# EAGLE schematic pcb_v2.0 (EAGLE 9.1.1)
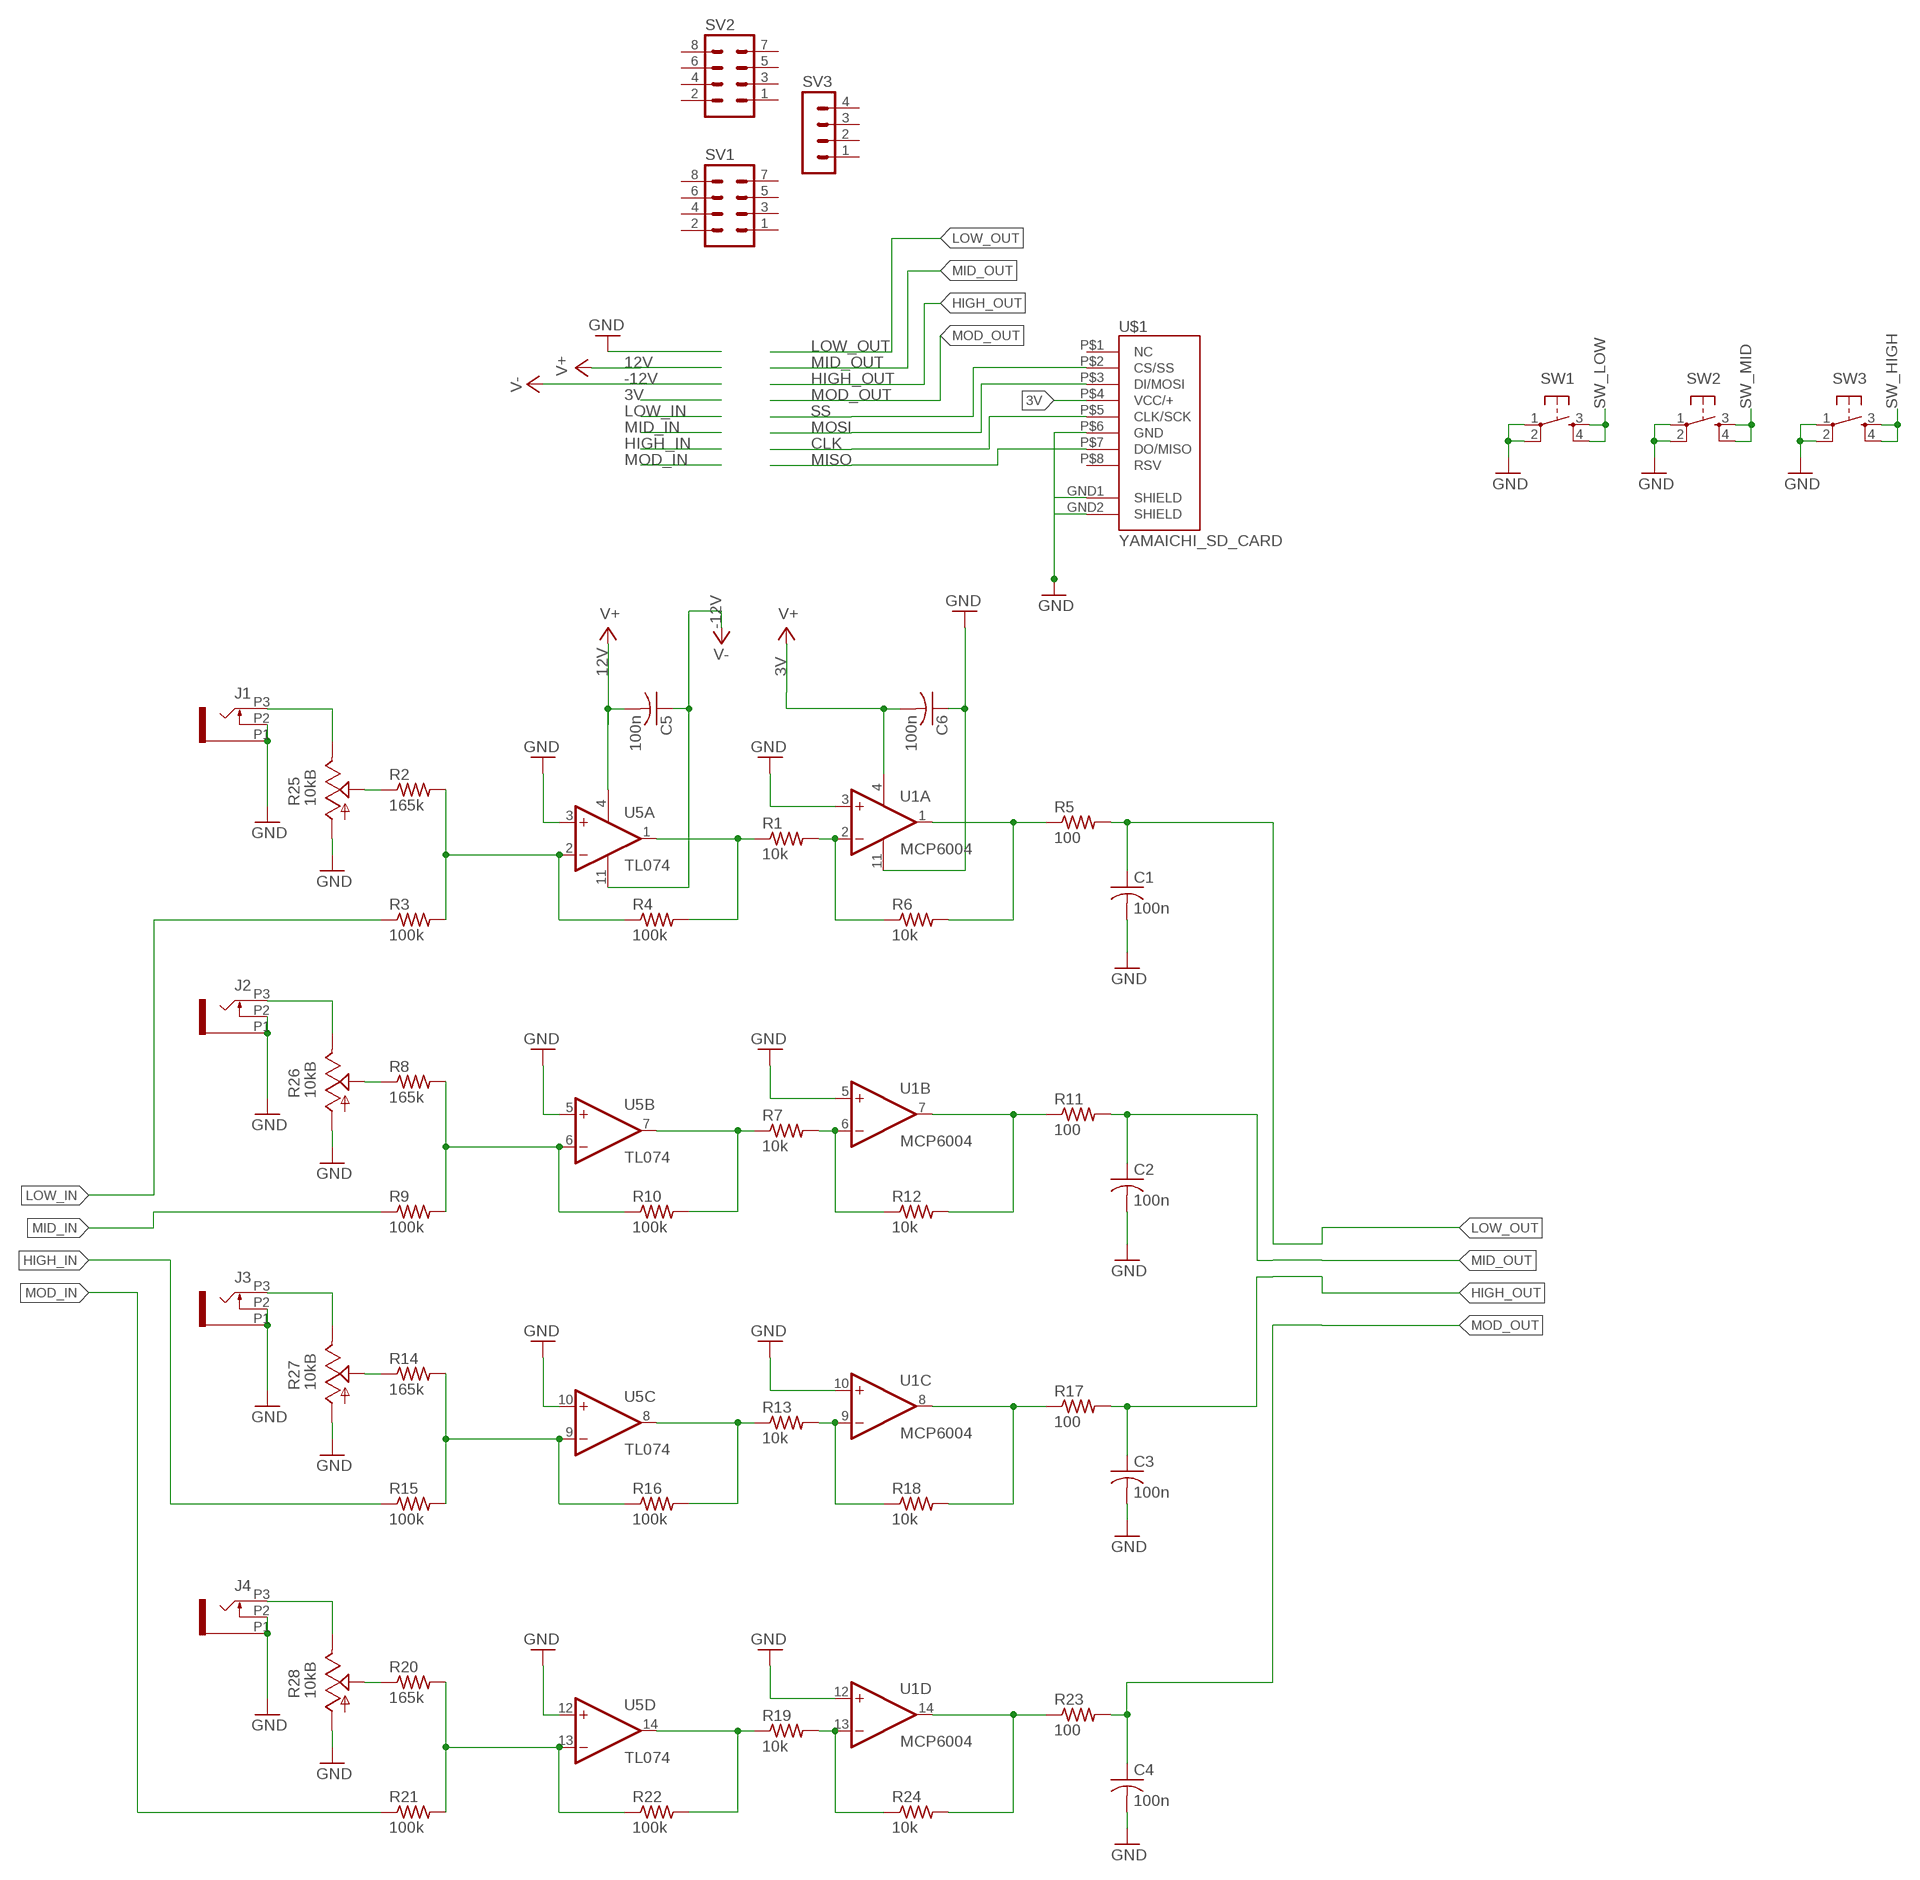
[diagram p0: schematic, sheet 1]

## Parts
C1  100n  C-USC0603  [C0603]
C2  100n  C-USC0603  [C0603]
C3  100n  C-USC0603  [C0603]
C4  100n  C-USC0603  [C0603]
C5  100n  C-USC0603  [C0603]
C6  100n  C-USC0603  [C0603]
J1  PJ301_THONKICONN6  [WQP_PJ_301M6]
J2  PJ301_THONKICONN6  [WQP_PJ_301M6]
J3  PJ301_THONKICONN6  [WQP_PJ_301M6]
J4  PJ301_THONKICONN6  [WQP_PJ_301M6]
R1  10k  R-US_R0603  [R0603]
R2  165k  R-US_R0603  [R0603]
R3  100k  R-US_R0603  [R0603]
R4  100k  R-US_R0603  [R0603]
R5  100  R-US_R0603  [R0603]
R6  10k  R-US_R0603  [R0603]
R7  10k  R-US_R0603  [R0603]
R8  165k  R-US_R0603  [R0603]
R9  100k  R-US_R0603  [R0603]
R10  100k  R-US_R0603  [R0603]
R11  100  R-US_R0603  [R0603]
R12  10k  R-US_R0603  [R0603]
R13  10k  R-US_R0603  [R0603]
R14  165k  R-US_R0603  [R0603]
R15  100k  R-US_R0603  [R0603]
R16  100k  R-US_R0603  [R0603]
R17  100  R-US_R0603  [R0603]
R18  10k  R-US_R0603  [R0603]
R19  10k  R-US_R0603  [R0603]
R20  165k  R-US_R0603  [R0603]
R21  100k  R-US_R0603  [R0603]
R22  100k  R-US_R0603  [R0603]
R23  100  R-US_R0603  [R0603]
R24  10k  R-US_R0603  [R0603]
R25  10kB  POT_USVERTICAL  [ALPS_POT_VERTICAL]
R26  10kB  POT_USVERTICAL  [ALPS_POT_VERTICAL]
R27  10kB  POT_USVERTICAL  [ALPS_POT_VERTICAL]
R28  10kB  POT_USVERTICAL  [ALPS_POT_VERTICAL]
SV1  MA04-2  [MA04-2]
SV2  MA04-2  [MA04-2]
SV3  MA04-1  [MA04-1]
SW1  TAC_SWITCHPTH  [TACTILE-PTH]
SW2  TAC_SWITCHPTH  [TACTILE-PTH]
SW3  TAC_SWITCHPTH  [TACTILE-PTH]
U1  MCP6004  MCP6004_SMD  [SO14]
U5  TL074  TL074_SMD  [SO14]
U$1  YAMAICHI_SD_CARD  [YAMAICHI_MICROSD_VERTICAL]

## Nets
3V: C6.2 U1.4(P:V+) ; supply symbol labelled V+
12V: C5.2 U5.4(P:V+) ; supply symbol labelled V+
-12V: C5.1 U5.11(P:V-) ; supply symbol labelled V-
CLK: U$1.P$5(CLK/SCK)
GND: C1.2 C2.2 C3.2 C4.2 C6.1 J1.P1 J1.P2 J2.P1 J2.P2 J3.P1 J3.P2 J4.P1 J4.P2 R25.P$3(A) R26.P$3(A) R27.P$3(A) R28.P$3(A) SW1.1 SW1.2 SW2.1 SW2.2 SW3.1 SW3.2 U1.3(A:+IN) U1.5(B:+IN) U1.10(C:+IN) U1.11(P:V-) U1.12(D:+IN) U5.3(A:+IN) U5.5(B:+IN) U5.10(C:+IN) U5.12(D:+IN) U$1.GND1(SHIELD) U$1.GND2(SHIELD) U$1.P$6(GND)
HIGH_IN: R15.1
HIGH_OUT: C3.1 R17.2
LOW_IN: R3.1
LOW_OUT: C1.1 R5.2
MID_IN: R9.1
MID_OUT: C2.1 R11.2
MISO: U$1.P$7(DO/MISO)
MOD_IN: R21.1
MOD_OUT: C4.1 R23.2
MOSI: U$1.P$3(DI/MOSI)
N$1: J1.P3 R25.P$1(E)
N$2: J2.P3 R26.P$1(E)
N$3: R2.2 R3.2 R4.1 U5.2(A:-IN)
N$4: R1.1 R4.2 U5.1(A:OUT)
N$5: R5.1 R6.2 U1.1(A:OUT)
N$6: J3.P3 R27.P$1(E)
N$7: J4.P3 R28.P$1(E)
N$8: R8.2 R9.2 R10.1 U5.6(B:-IN)
N$9: R7.1 R10.2 U5.7(B:OUT)
N$10: R2.1 R25.P$2(S)
N$11: R8.1 R26.P$2(S)
N$12: R14.1 R27.P$2(S)
N$13: R14.2 R15.2 R16.1 U5.9(C:-IN)
N$14: R13.1 R16.2 U5.8(C:OUT)
N$15: R20.1 R28.P$2(S)
N$16: U$1.P$4(VCC/+)
N$18: R20.2 R21.2 R22.1 U5.13(D:-IN)
N$19: R19.1 R22.2 U5.14(D:OUT)
N$20: R1.2 R6.1 U1.2(A:-IN)
N$22: R7.2 R12.1 U1.6(B:-IN)
N$23: R13.2 R18.1 U1.9(C:-IN)
N$24: R19.2 R24.1 U1.13(D:-IN)
N$26: R11.1 R12.2 U1.7(B:OUT)
N$27: R17.1 R18.2 U1.8(C:OUT)
N$28: R23.1 R24.2 U1.14(D:OUT)
SS: U$1.P$2(CS/SS)
SW_HIGH: SW3.3 SW3.4
SW_LOW: SW1.3 SW1.4
SW_MID: SW2.3 SW2.4
Unconnected: SV1.1 SV1.2 SV1.3 SV1.4 SV1.5 SV1.6 SV1.7 SV1.8 SV2.1 SV2.2 SV2.3 SV2.4 SV2.5 SV2.6 SV2.7 SV2.8 SV3.1 SV3.2 SV3.3 SV3.4 U$1.P$1(NC) U$1.P$8(RSV)

## Library data of the parts
C1-C6 = rcl:C-US: CAPACITOR, American symbol; SPICEPREFIX: C
J1-J4 = og-pj301:PJ301_THONKICONN; SPICEPREFIX: J
R1-R24 = rcl:R-US_: RESISTOR, American symbol; SPICEPREFIX: R
R25-R28 = og-pots:POT_US
SV1 SV2 = con-lstb:MA04-2: PIN HEADER; OC_FARNELL: unknown; OC_NEWARK: unknown
SV3 = con-lstb:MA04-1: PIN HEADER; OC_FARNELL: unknown; OC_NEWARK: unknown
SW1-SW3 = SparkFun:TAC_SWITCH: Momentary Switch Button commonly used for reset or general input. Spark Fun Electronics SKU : COM-00097
U1 = MusicThingModular:MCP6004: Generic Quad Op Amp
U5 = MusicThingModular:TL074: Generic Quad Op Amp
U$1 = MusicThingModular:YAMAICHI_SD_CARD: Vertical SD Card Holder